# EAGLE design Tacho_StdTeile_panel (EAGLE 6.5.0)

## Sheet 1 of 8
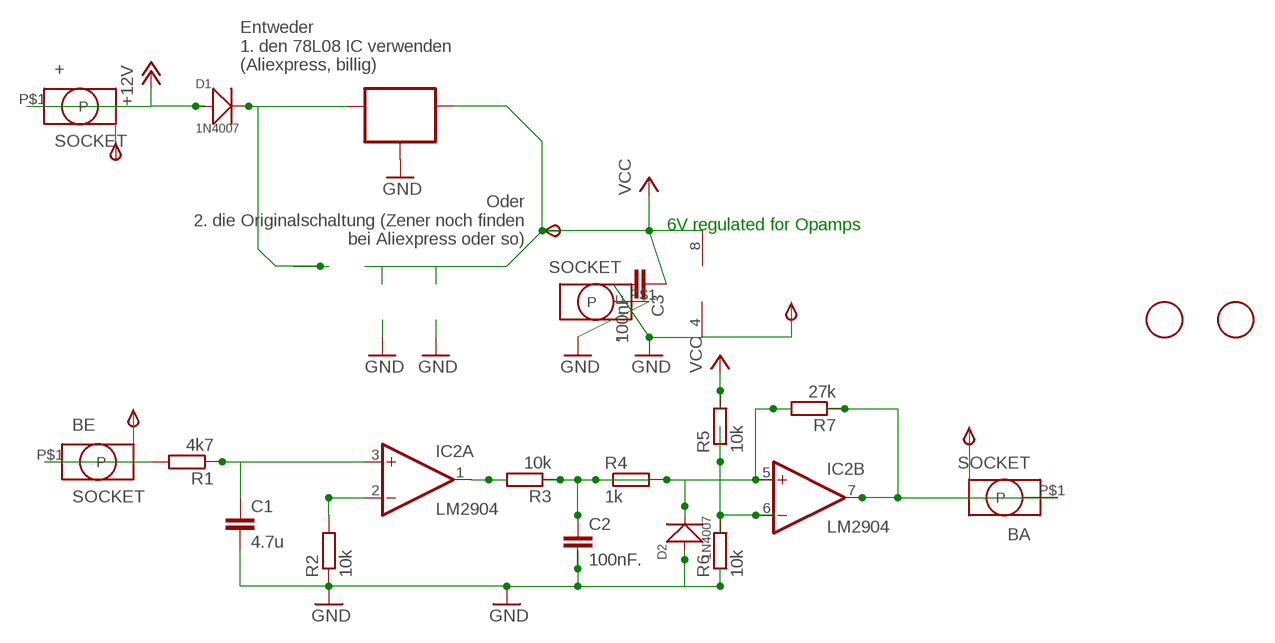
[diagram p0: schematic, sheet 1]

### Parts
6V  TPSB2.0  [B2.0]
+  SOCKET  [ID2.5MM]
+12V  TPSB2.0  [B2.0]
-  SOCKET  [ID2.5MM]
AUS  TPSB2.0  [B2.0]
BA  SOCKET  [ID2.5MM]
BE  SOCKET  [ID2.5MM]
C1  4.7u  C-EUC0805K  [C0805K]
C2  100nF.  C-EUC0805K  [C0805K]
C3  100nF  C-EUC0805K  [C0805K]
D1  1N4007  DIODE-GEN-PURPOSE-1KV-1A(DO-214AC)  [DO-214AC]
D2  1N4007  DIODE-GEN-PURPOSE-1KV-1A(DO-214AC)  [DO-214AC]
EIN  TPSB2.0  [B2.0]
FID2  FIDUCIAL  [FIDUCIAL_1MM]
FID20  FIDUCIAL  [FIDUCIAL_1MM]
GND  TPSB2.0  [B2.0]
IC1  78L06  78LXXSOT89_ROUND  [SOT89_ROUND]
IC2  LM2904  LM358D  [SO08]
R1  4k7  R-EU_R0805  [R0805]
R2  10k  R-EU_R0805  [R0805]
R3  10k  R-EU_R0805  [R0805]
R4  1k  R-EU_R0805  [R0805]
R5  10k  R-EU_R0805  [R0805]
R6  10k  R-EU_R0805  [R0805]
R7  27k  R-EU_R0805  [R0805]

### Nets
+12V: +12V.TP(PP) +.P$1(P) D1.1(+) ; also sheet 2,3,4,5,6,7,8
+12V1: AUS.TP(PP) BA.P$1(P) IC2.7(B:OUT) R7.1
GND: -.P$1(P) C1.2 C2.2 C3.2 D2.1(+) GND.TP(PP) IC1.2(GND) IC1.2@1(GND) IC2.4(P:V-) R2.1 R6.1 ; also sheet 2,3,4,5,6,7,8
N$5: D1.2(-) IC1.3(IN)
N$7: IC2.2(A:-IN) R2.2
N$23: BE.P$1(P) EIN.TP(PP) R1.2
N$24: C1.1 IC2.3(A:+IN) R1.1
N$92: IC2.1(A:OUT) R3.2
N$96: C2.1 R3.1 R4.1
N$97: D2.2(-) IC2.5(B:+IN) R4.2 R7.2
N$101: IC2.6(B:-IN) R5.1 R6.2
VCC: 6V.TP(PP) C3.1 IC1.1(OUT) IC2.8(P:V+) R5.2 ; also sheet 2,3,4,5,6,7,8

### Notes on the sheet
- Entweder
  1. den 78L08 IC verwenden 
  (Aliexpress, billig)
- Oder
  2. die Originalschaltung (Zener noch finden
  bei Aliexpress oder so)
- 6V regulated for Opamps

## Sheet 2 of 8
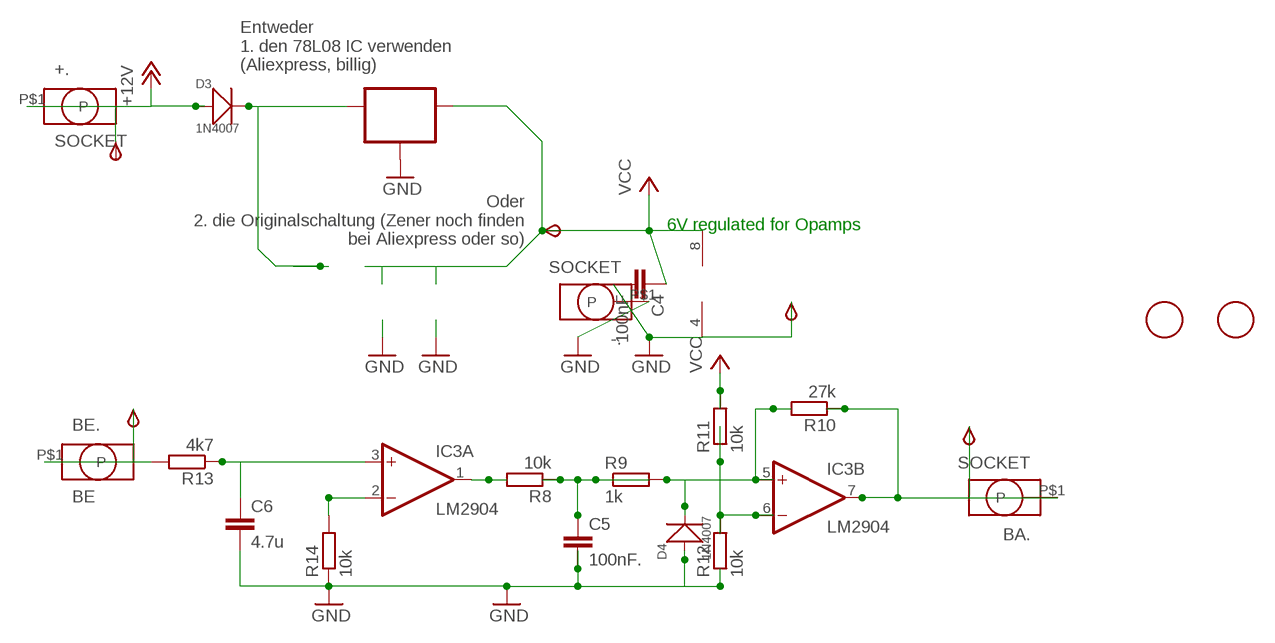
[diagram p1: schematic, sheet 2]

### Parts
6V1  TPSB2.0  [B2.0]
+12V1  TPSB2.0  [B2.0]
+.  SOCKET  [ID2.5MM]
-.  SOCKET  [ID2.5MM]
AUS1  TPSB2.0  [B2.0]
BA.  SOCKET  [ID2.5MM]
BE.  BE  SOCKET  [ID2.5MM]
C4  100nF  C-EUC0805K  [C0805K]
C5  100nF.  C-EUC0805K  [C0805K]
C6  4.7u  C-EUC0805K  [C0805K]
D3  1N4007  DIODE-GEN-PURPOSE-1KV-1A(DO-214AC)  [DO-214AC]
D4  1N4007  DIODE-GEN-PURPOSE-1KV-1A(DO-214AC)  [DO-214AC]
EIN1  TPSB2.0  [B2.0]
FID3  FIDUCIAL  [FIDUCIAL_1MM]
FID4  FIDUCIAL  [FIDUCIAL_1MM]
GND12  TPSB2.0  [B2.0]
IC3  LM2904  LM358D  [SO08]
IC4  78L06  78LXXSOT89_ROUND  [SOT89_ROUND]
R8  10k  R-EU_R0805  [R0805]
R9  1k  R-EU_R0805  [R0805]
R10  27k  R-EU_R0805  [R0805]
R11  10k  R-EU_R0805  [R0805]
R12  10k  R-EU_R0805  [R0805]
R13  4k7  R-EU_R0805  [R0805]
R14  10k  R-EU_R0805  [R0805]

### Nets
+12V: +12V1.TP(PP) +..P$1(P) D3.1(+) ; also sheet 1,3,4,5,6,7,8
+12V2: AUS1.TP(PP) BA..P$1(P) IC3.7(B:OUT) R10.1
GND: -..P$1(P) C4.2 C5.2 C6.2 D4.1(+) GND12.TP(PP) IC3.4(P:V-) IC4.2(GND) IC4.2@1(GND) R12.1 R14.1 ; also sheet 1,3,4,5,6,7,8
N$1: IC3.2(A:-IN) R14.2
N$2: IC3.1(A:OUT) R8.2
N$4: C5.1 R8.1 R9.1
N$6: D4.2(-) IC3.5(B:+IN) R9.2 R10.2
N$8: IC3.6(B:-IN) R11.1 R12.2
N$9: BE..P$1(P) EIN1.TP(PP) R13.2
N$10: C6.1 IC3.3(A:+IN) R13.1
N$11: D3.2(-) IC4.3(IN)
VCC: 6V1.TP(PP) C4.1 IC3.8(P:V+) IC4.1(OUT) R11.2 ; also sheet 1,3,4,5,6,7,8

### Notes on the sheet
- Entweder
  1. den 78L08 IC verwenden 
  (Aliexpress, billig)
- Oder
  2. die Originalschaltung (Zener noch finden
  bei Aliexpress oder so)
- 6V regulated for Opamps

## Sheet 3 of 8
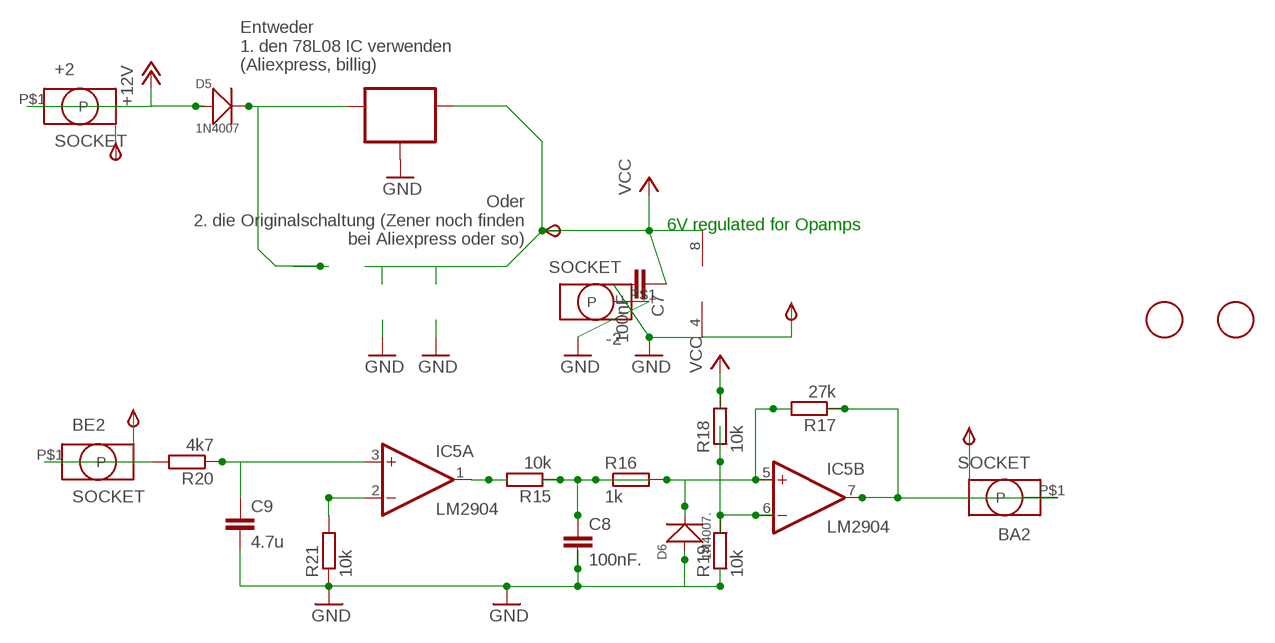
[diagram p2: schematic, sheet 3]

### Parts
6V2  TPSB2.0  [B2.0]
+2  SOCKET  [ID2.5MM]
+12V2  TPSB2.0  [B2.0]
-2  SOCKET  [ID2.5MM]
AUS2  TPSB2.0  [B2.0]
BA2  SOCKET  [ID2.5MM]
BE2  SOCKET  [ID2.5MM]
C7  100nF  C-EUC0805K  [C0805K]
C8  100nF.  C-EUC0805K  [C0805K]
C9  4.7u  C-EUC0805K  [C0805K]
D5  1N4007  DIODE-GEN-PURPOSE-1KV-1A(DO-214AC)  [DO-214AC]
D6  1N4007.  DIODE-GEN-PURPOSE-1KV-1A(DO-214AC)  [DO-214AC]
EIN2  TPSB2.0  [B2.0]
FID5  FIDUCIAL  [FIDUCIAL_1MM]
FID6  FIDUCIAL  [FIDUCIAL_1MM]
GND20  TPSB2.0  [B2.0]
IC5  LM2904  LM358D  [SO08]
IC6  78L06  78LXXSOT89_ROUND  [SOT89_ROUND]
R15  10k  R-EU_R0805  [R0805]
R16  1k  R-EU_R0805  [R0805]
R17  27k  R-EU_R0805  [R0805]
R18  10k  R-EU_R0805  [R0805]
R19  10k  R-EU_R0805  [R0805]
R20  4k7  R-EU_R0805  [R0805]
R21  10k  R-EU_R0805  [R0805]

### Nets
+12V: +2.P$1(P) +12V2.TP(PP) D5.1(+) ; also sheet 1,2,4,5,6,7,8
+12V3: AUS2.TP(PP) BA2.P$1(P) IC5.7(B:OUT) R17.1
GND: -2.P$1(P) C7.2 C8.2 C9.2 D6.1(+) GND20.TP(PP) IC5.4(P:V-) IC6.2(GND) IC6.2@1(GND) R19.1 R21.1 ; also sheet 1,2,4,5,6,7,8
N$17: IC5.2(A:-IN) R21.2
N$18: IC5.1(A:OUT) R15.2
N$19: C8.1 R15.1 R16.1
N$20: D6.2(-) IC5.5(B:+IN) R16.2 R17.2
N$21: IC5.6(B:-IN) R18.1 R19.2
N$22: BE2.P$1(P) EIN2.TP(PP) R20.2
N$25: C9.1 IC5.3(A:+IN) R20.1
N$26: D5.2(-) IC6.3(IN)
VCC: 6V2.TP(PP) C7.1 IC5.8(P:V+) IC6.1(OUT) R18.2 ; also sheet 1,2,4,5,6,7,8

### Notes on the sheet
- Entweder
  1. den 78L08 IC verwenden 
  (Aliexpress, billig)
- Oder
  2. die Originalschaltung (Zener noch finden
  bei Aliexpress oder so)
- 6V regulated for Opamps

## Sheet 4 of 8
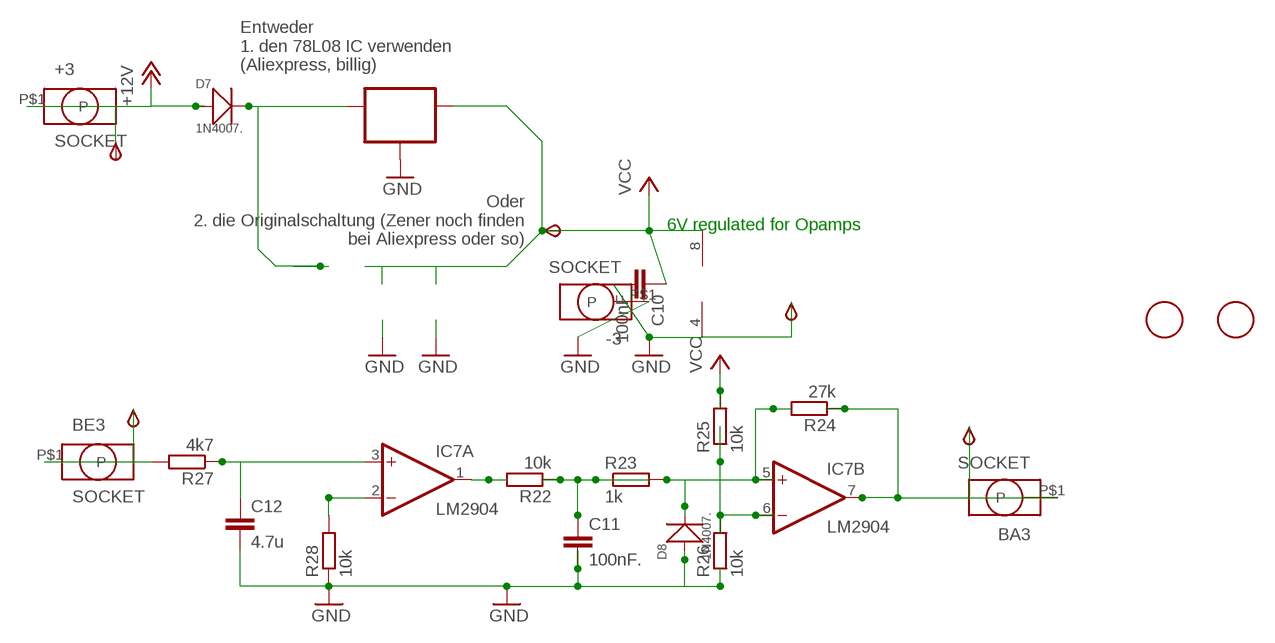
[diagram p3: schematic, sheet 4]

### Parts
6V3  TPSB2.0  [B2.0]
+3  SOCKET  [ID2.5MM]
+12V3  TPSB2.0  [B2.0]
-3  SOCKET  [ID2.5MM]
AUS3  TPSB2.0  [B2.0]
BA3  SOCKET  [ID2.5MM]
BE3  SOCKET  [ID2.5MM]
C10  100nF  C-EUC0805K  [C0805K]
C11  100nF.  C-EUC0805K  [C0805K]
C12  4.7u  C-EUC0805K  [C0805K]
D7  1N4007.  DIODE-GEN-PURPOSE-1KV-1A(DO-214AC)  [DO-214AC]
D8  1N4007.  DIODE-GEN-PURPOSE-1KV-1A(DO-214AC)  [DO-214AC]
EIN3  TPSB2.0  [B2.0]
FID7  FIDUCIAL  [FIDUCIAL_1MM]
FID8  FIDUCIAL  [FIDUCIAL_1MM]
GND29  TPSB2.0  [B2.0]
IC7  LM2904  LM358D  [SO08]
IC8  78L06  78LXXSOT89_ROUND  [SOT89_ROUND]
R22  10k  R-EU_R0805  [R0805]
R23  1k  R-EU_R0805  [R0805]
R24  27k  R-EU_R0805  [R0805]
R25  10k  R-EU_R0805  [R0805]
R26  10k  R-EU_R0805  [R0805]
R27  4k7  R-EU_R0805  [R0805]
R28  10k  R-EU_R0805  [R0805]

### Nets
+12V: +3.P$1(P) +12V3.TP(PP) D7.1(+) ; also sheet 1,2,3,5,6,7,8
+12V4: AUS3.TP(PP) BA3.P$1(P) IC7.7(B:OUT) R24.1
GND: -3.P$1(P) C10.2 C11.2 C12.2 D8.1(+) GND29.TP(PP) IC7.4(P:V-) IC8.2(GND) IC8.2@1(GND) R26.1 R28.1 ; also sheet 1,2,3,5,6,7,8
N$27: IC7.2(A:-IN) R28.2
N$28: IC7.1(A:OUT) R22.2
N$29: C11.1 R22.1 R23.1
N$30: D8.2(-) IC7.5(B:+IN) R23.2 R24.2
N$31: IC7.6(B:-IN) R25.1 R26.2
N$32: BE3.P$1(P) EIN3.TP(PP) R27.2
N$33: C12.1 IC7.3(A:+IN) R27.1
N$34: D7.2(-) IC8.3(IN)
VCC: 6V3.TP(PP) C10.1 IC7.8(P:V+) IC8.1(OUT) R25.2 ; also sheet 1,2,3,5,6,7,8

### Notes on the sheet
- Entweder
  1. den 78L08 IC verwenden 
  (Aliexpress, billig)
- Oder
  2. die Originalschaltung (Zener noch finden
  bei Aliexpress oder so)
- 6V regulated for Opamps

## Sheet 5 of 8
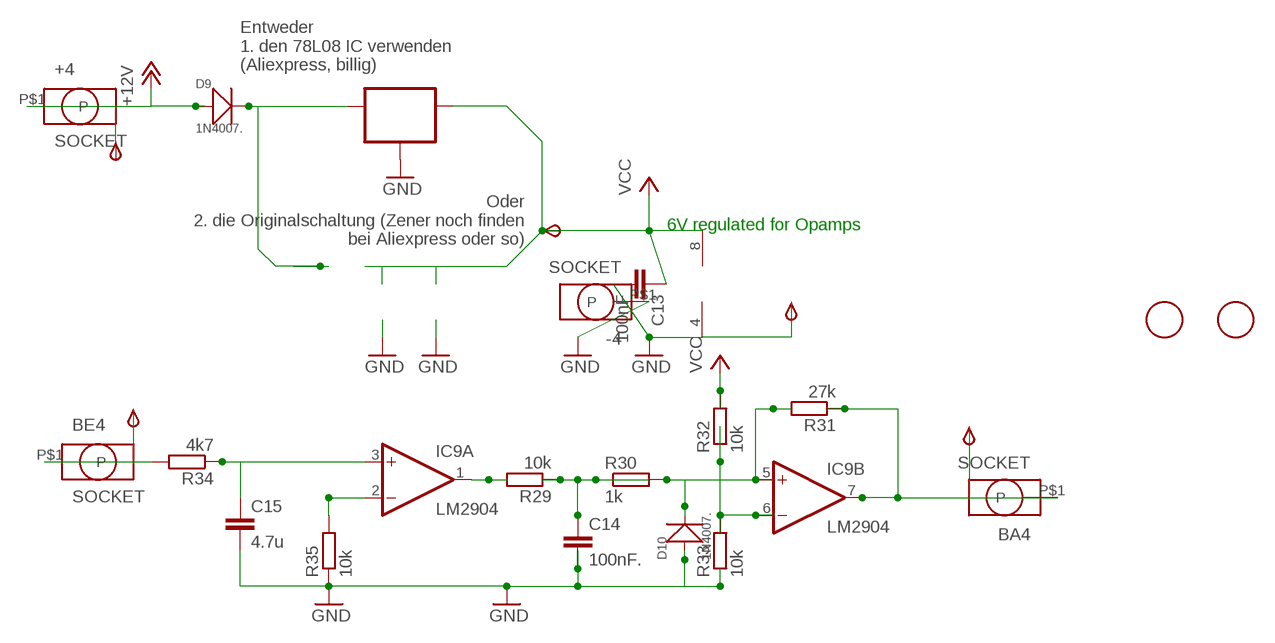
[diagram p4: schematic, sheet 5]

### Parts
6V4  TPSB2.0  [B2.0]
+4  SOCKET  [ID2.5MM]
+12V4  TPSB2.0  [B2.0]
-4  SOCKET  [ID2.5MM]
AUS4  TPSB2.0  [B2.0]
BA4  SOCKET  [ID2.5MM]
BE4  SOCKET  [ID2.5MM]
C13  100nF  C-EUC0805K  [C0805K]
C14  100nF.  C-EUC0805K  [C0805K]
C15  4.7u  C-EUC0805K  [C0805K]
D9  1N4007.  DIODE-GEN-PURPOSE-1KV-1A(DO-214AC)  [DO-214AC]
D10  1N4007.  DIODE-GEN-PURPOSE-1KV-1A(DO-214AC)  [DO-214AC]
EIN4  TPSB2.0  [B2.0]
FID9  FIDUCIAL  [FIDUCIAL_1MM]
FID10  FIDUCIAL  [FIDUCIAL_1MM]
GND39  TPSB2.0  [B2.0]
IC9  LM2904  LM358D  [SO08]
IC10  78L06  78LXXSOT89_ROUND  [SOT89_ROUND]
R29  10k  R-EU_R0805  [R0805]
R30  1k  R-EU_R0805  [R0805]
R31  27k  R-EU_R0805  [R0805]
R32  10k  R-EU_R0805  [R0805]
R33  10k  R-EU_R0805  [R0805]
R34  4k7  R-EU_R0805  [R0805]
R35  10k  R-EU_R0805  [R0805]

### Nets
+12V: +4.P$1(P) +12V4.TP(PP) D9.1(+) ; also sheet 1,2,3,4,6,7,8
+12V5: AUS4.TP(PP) BA4.P$1(P) IC9.7(B:OUT) R31.1
GND: -4.P$1(P) C13.2 C14.2 C15.2 D10.1(+) GND39.TP(PP) IC9.4(P:V-) IC10.2(GND) IC10.2@1(GND) R33.1 R35.1 ; also sheet 1,2,3,4,6,7,8
N$46: IC9.2(A:-IN) R35.2
N$47: IC9.1(A:OUT) R29.2
N$48: C14.1 R29.1 R30.1
N$49: D10.2(-) IC9.5(B:+IN) R30.2 R31.2
N$50: IC9.6(B:-IN) R32.1 R33.2
N$51: BE4.P$1(P) EIN4.TP(PP) R34.2
N$52: C15.1 IC9.3(A:+IN) R34.1
N$53: D9.2(-) IC10.3(IN)
VCC: 6V4.TP(PP) C13.1 IC9.8(P:V+) IC10.1(OUT) R32.2 ; also sheet 1,2,3,4,6,7,8

### Notes on the sheet
- Entweder
  1. den 78L08 IC verwenden 
  (Aliexpress, billig)
- Oder
  2. die Originalschaltung (Zener noch finden
  bei Aliexpress oder so)
- 6V regulated for Opamps

## Sheet 6 of 8
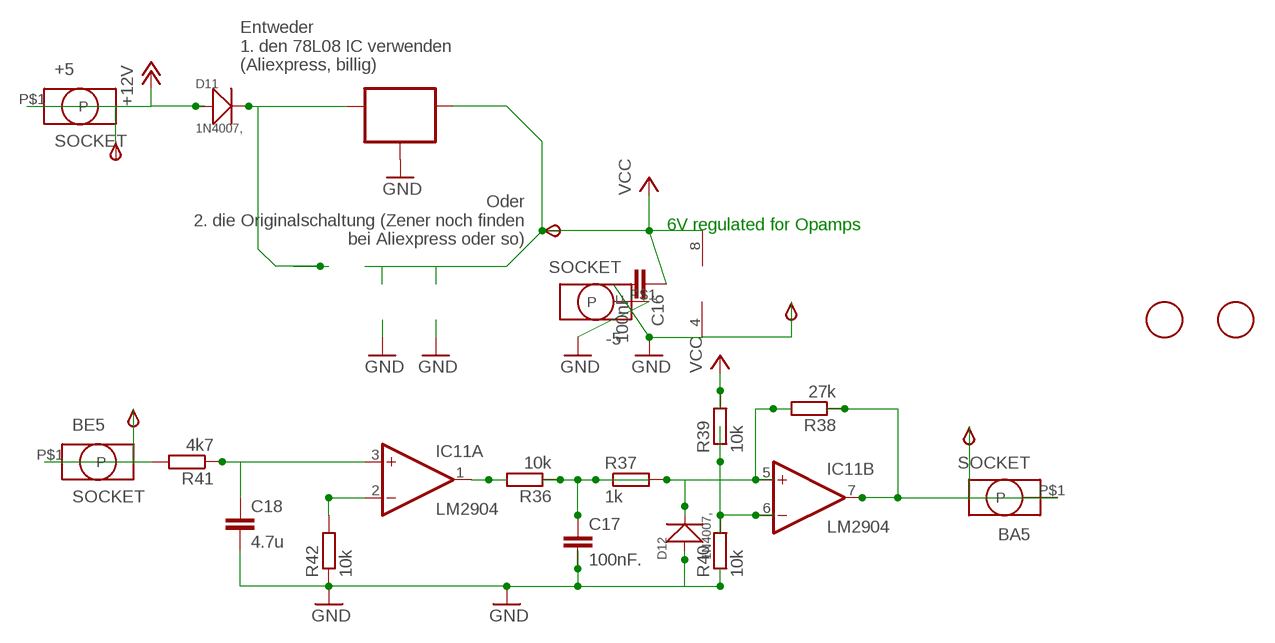
[diagram p5: schematic, sheet 6]

### Parts
6V5  TPSB2.0  [B2.0]
+5  SOCKET  [ID2.5MM]
+12V5  TPSB2.0  [B2.0]
-5  SOCKET  [ID2.5MM]
AUS5  TPSB2.0  [B2.0]
BA5  SOCKET  [ID2.5MM]
BE5  SOCKET  [ID2.5MM]
C16  100nF  C-EUC0805K  [C0805K]
C17  100nF.  C-EUC0805K  [C0805K]
C18  4.7u  C-EUC0805K  [C0805K]
D11  1N4007,  DIODE-GEN-PURPOSE-1KV-1A(DO-214AC)  [DO-214AC]
D12  1N4007,  DIODE-GEN-PURPOSE-1KV-1A(DO-214AC)  [DO-214AC]
EIN5  TPSB2.0  [B2.0]
FID11  FIDUCIAL  [FIDUCIAL_1MM]
FID12  FIDUCIAL  [FIDUCIAL_1MM]
GND47  TPSB2.0  [B2.0]
IC11  LM2904  LM358D  [SO08]
IC12  78L06  78LXXSOT89_ROUND  [SOT89_ROUND]
R36  10k  R-EU_R0805  [R0805]
R37  1k  R-EU_R0805  [R0805]
R38  27k  R-EU_R0805  [R0805]
R39  10k  R-EU_R0805  [R0805]
R40  10k  R-EU_R0805  [R0805]
R41  4k7  R-EU_R0805  [R0805]
R42  10k  R-EU_R0805  [R0805]

### Nets
+12V: +5.P$1(P) +12V5.TP(PP) D11.1(+) ; also sheet 1,2,3,4,5,7,8
+12V6: AUS5.TP(PP) BA5.P$1(P) IC11.7(B:OUT) R38.1
GND: -5.P$1(P) C16.2 C17.2 C18.2 D12.1(+) GND47.TP(PP) IC11.4(P:V-) IC12.2(GND) IC12.2@1(GND) R40.1 R42.1 ; also sheet 1,2,3,4,5,7,8
N$54: IC11.2(A:-IN) R42.2
N$55: IC11.1(A:OUT) R36.2
N$56: C17.1 R36.1 R37.1
N$57: D12.2(-) IC11.5(B:+IN) R37.2 R38.2
N$58: IC11.6(B:-IN) R39.1 R40.2
N$59: BE5.P$1(P) EIN5.TP(PP) R41.2
N$60: C18.1 IC11.3(A:+IN) R41.1
N$61: D11.2(-) IC12.3(IN)
VCC: 6V5.TP(PP) C16.1 IC11.8(P:V+) IC12.1(OUT) R39.2 ; also sheet 1,2,3,4,5,7,8

### Notes on the sheet
- Entweder
  1. den 78L08 IC verwenden 
  (Aliexpress, billig)
- Oder
  2. die Originalschaltung (Zener noch finden
  bei Aliexpress oder so)
- 6V regulated for Opamps

## Sheet 7 of 8
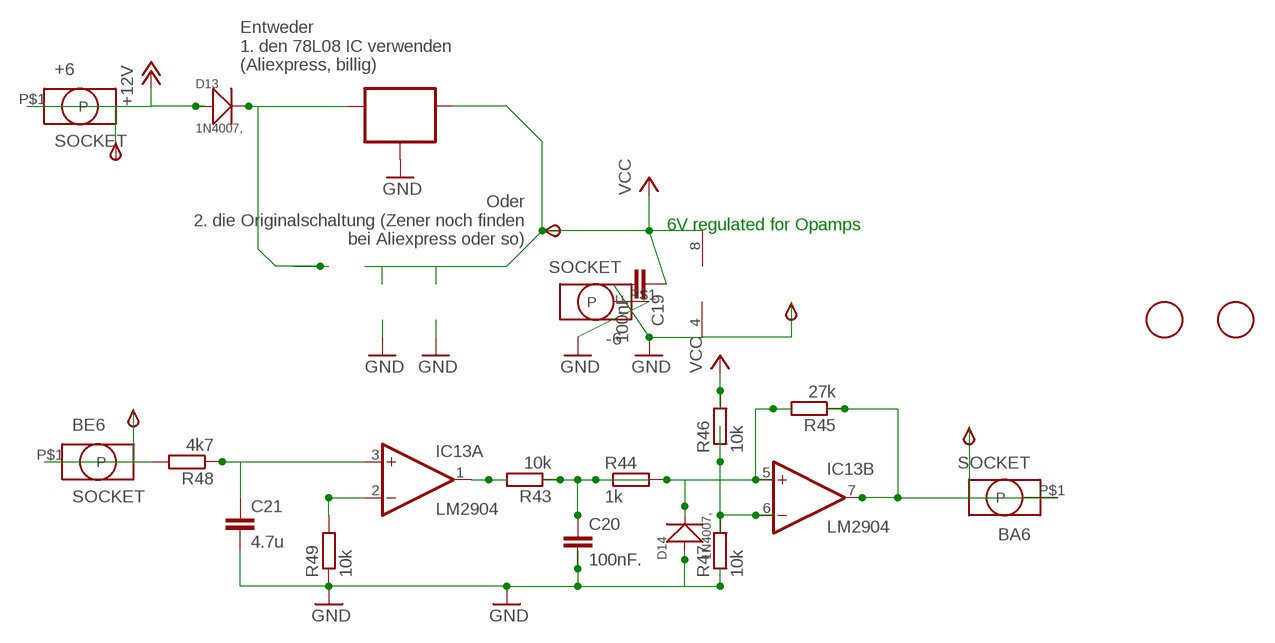
[diagram p6: schematic, sheet 7]

### Parts
6V6  TPSB2.0  [B2.0]
+6  SOCKET  [ID2.5MM]
+12V6  TPSB2.0  [B2.0]
-6  SOCKET  [ID2.5MM]
AUS6  TPSB2.0  [B2.0]
BA6  SOCKET  [ID2.5MM]
BE6  SOCKET  [ID2.5MM]
C19  100nF  C-EUC0805K  [C0805K]
C20  100nF.  C-EUC0805K  [C0805K]
C21  4.7u  C-EUC0805K  [C0805K]
D13  1N4007,  DIODE-GEN-PURPOSE-1KV-1A(DO-214AC)  [DO-214AC]
D14  1N4007,  DIODE-GEN-PURPOSE-1KV-1A(DO-214AC)  [DO-214AC]
EIN6  TPSB2.0  [B2.0]
FID13  FIDUCIAL  [FIDUCIAL_1MM]
FID14  FIDUCIAL  [FIDUCIAL_1MM]
GND55  TPSB2.0  [B2.0]
IC13  LM2904  LM358D  [SO08]
IC14  78L06  78LXXSOT89_ROUND  [SOT89_ROUND]
R43  10k  R-EU_R0805  [R0805]
R44  1k  R-EU_R0805  [R0805]
R45  27k  R-EU_R0805  [R0805]
R46  10k  R-EU_R0805  [R0805]
R47  10k  R-EU_R0805  [R0805]
R48  4k7  R-EU_R0805  [R0805]
R49  10k  R-EU_R0805  [R0805]

### Nets
+12V: +6.P$1(P) +12V6.TP(PP) D13.1(+) ; also sheet 1,2,3,4,5,6,8
+12V7: AUS6.TP(PP) BA6.P$1(P) IC13.7(B:OUT) R45.1
GND: -6.P$1(P) C19.2 C20.2 C21.2 D14.1(+) GND55.TP(PP) IC13.4(P:V-) IC14.2(GND) IC14.2@1(GND) R47.1 R49.1 ; also sheet 1,2,3,4,5,6,8
N$63: IC13.2(A:-IN) R49.2
N$64: IC13.1(A:OUT) R43.2
N$65: C20.1 R43.1 R44.1
N$67: D14.2(-) IC13.5(B:+IN) R44.2 R45.2
N$69: IC13.6(B:-IN) R46.1 R47.2
N$70: BE6.P$1(P) EIN6.TP(PP) R48.2
N$71: C21.1 IC13.3(A:+IN) R48.1
N$72: D13.2(-) IC14.3(IN)
VCC: 6V6.TP(PP) C19.1 IC13.8(P:V+) IC14.1(OUT) R46.2 ; also sheet 1,2,3,4,5,6,8

### Notes on the sheet
- Entweder
  1. den 78L08 IC verwenden 
  (Aliexpress, billig)
- Oder
  2. die Originalschaltung (Zener noch finden
  bei Aliexpress oder so)
- 6V regulated for Opamps

## Sheet 8 of 8
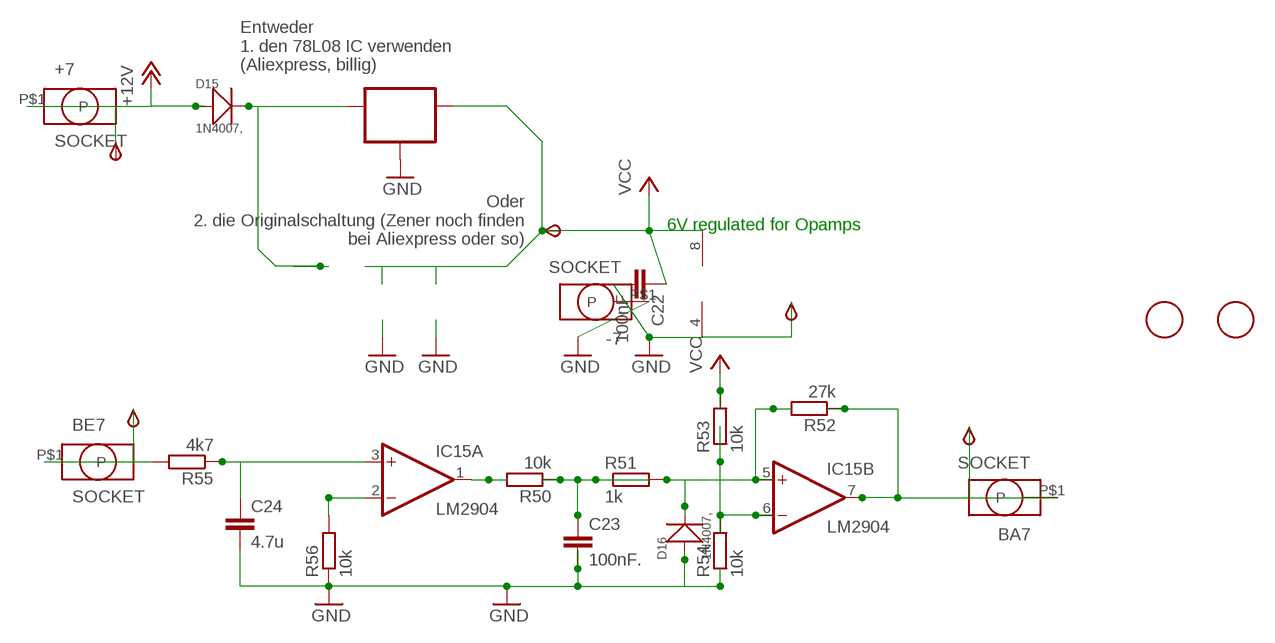
[diagram p7: schematic, sheet 8]

### Parts
6V7  TPSB2.0  [B2.0]
+7  SOCKET  [ID2.5MM]
+12V7  TPSB2.0  [B2.0]
-7  SOCKET  [ID2.5MM]
AUS7  TPSB2.0  [B2.0]
BA7  SOCKET  [ID2.5MM]
BE7  SOCKET  [ID2.5MM]
C22  100nF  C-EUC0805K  [C0805K]
C23  100nF.  C-EUC0805K  [C0805K]
C24  4.7u  C-EUC0805K  [C0805K]
D15  1N4007,  DIODE-GEN-PURPOSE-1KV-1A(DO-214AC)  [DO-214AC]
D16  1N4007,  DIODE-GEN-PURPOSE-1KV-1A(DO-214AC)  [DO-214AC]
EIN7  TPSB2.0  [B2.0]
FID1  FIDUCIAL  [FIDUCIAL_1MM]
FID19  FIDUCIAL  [FIDUCIAL_1MM]
GND63  TPSB2.0  [B2.0]
IC15  LM2904  LM358D  [SO08]
IC16  78L06  78LXXSOT89_ROUND  [SOT89_ROUND]
R50  10k  R-EU_R0805  [R0805]
R51  1k  R-EU_R0805  [R0805]
R52  27k  R-EU_R0805  [R0805]
R53  10k  R-EU_R0805  [R0805]
R54  10k  R-EU_R0805  [R0805]
R55  4k7  R-EU_R0805  [R0805]
R56  10k  R-EU_R0805  [R0805]

### Nets
+12V: +7.P$1(P) +12V7.TP(PP) D15.1(+) ; also sheet 1,2,3,4,5,6,7
+12V8: AUS7.TP(PP) BA7.P$1(P) IC15.7(B:OUT) R52.1
GND: -7.P$1(P) C22.2 C23.2 C24.2 D16.1(+) GND63.TP(PP) IC15.4(P:V-) IC16.2(GND) IC16.2@1(GND) R54.1 R56.1 ; also sheet 1,2,3,4,5,6,7
N$73: IC15.2(A:-IN) R56.2
N$74: IC15.1(A:OUT) R50.2
N$76: C23.1 R50.1 R51.1
N$77: D16.2(-) IC15.5(B:+IN) R51.2 R52.2
N$78: IC15.6(B:-IN) R53.1 R54.2
N$79: BE7.P$1(P) EIN7.TP(PP) R55.2
N$80: C24.1 IC15.3(A:+IN) R55.1
N$81: D15.2(-) IC16.3(IN)
VCC: 6V7.TP(PP) C22.1 IC15.8(P:V+) IC16.1(OUT) R53.2 ; also sheet 1,2,3,4,5,6,7

### Notes on the sheet
- Entweder
  1. den 78L08 IC verwenden 
  (Aliexpress, billig)
- Oder
  2. die Originalschaltung (Zener noch finden
  bei Aliexpress oder so)
- 6V regulated for Opamps

## Library data of the parts
6V 6V1-6V7 +12V +12V1-+12V7 AUS AUS1-AUS7 EIN EIN1-EIN7 GND GND12 GND20 GND29 GND39 GND47 GND55 GND63 = testpin_BMW:TPS: TEST PIN
+ +2-+7 +. - -2--7 -. BA BA2-BA7 BA. BE BE2-BE7 BE. = Brotbox_Socket_Header:SOCKET
C1-C24 = rcl:C-EU: CAPACITOR, European symbol
D1-D5 = Diode-do214ac:DIODE-GEN-PURPOSE-1KV-1A(DO-214AC): 304010013; MPN: 1N4007
D6-D16 = Diode-do214ac:DIODE-GEN-PURPOSE-1KV-1A(DO-214AC): 304010013; MPN: 1N4007; VALUE: 1N4007
FID1-FID14 FID19 FID20 = Fiducial:FIDUCIAL: For use by pick and place machines to calibrate the vision/machine, 1mm By microbuilder.eu
IC1 IC4 IC6 IC8 IC10 IC12 IC14 IC16 = 78LXX:78LXX
IC2 IC3 IC5 IC7 IC9 IC11 IC13 IC15 = linear_BMW:LM358: OP AMP also LM158; LM258; LM2904 Source: http://cache.national.com/ds/LM/LM158.pdf
R1-R56 = rcl:R-EU_: RESISTOR, European symbol

## Board
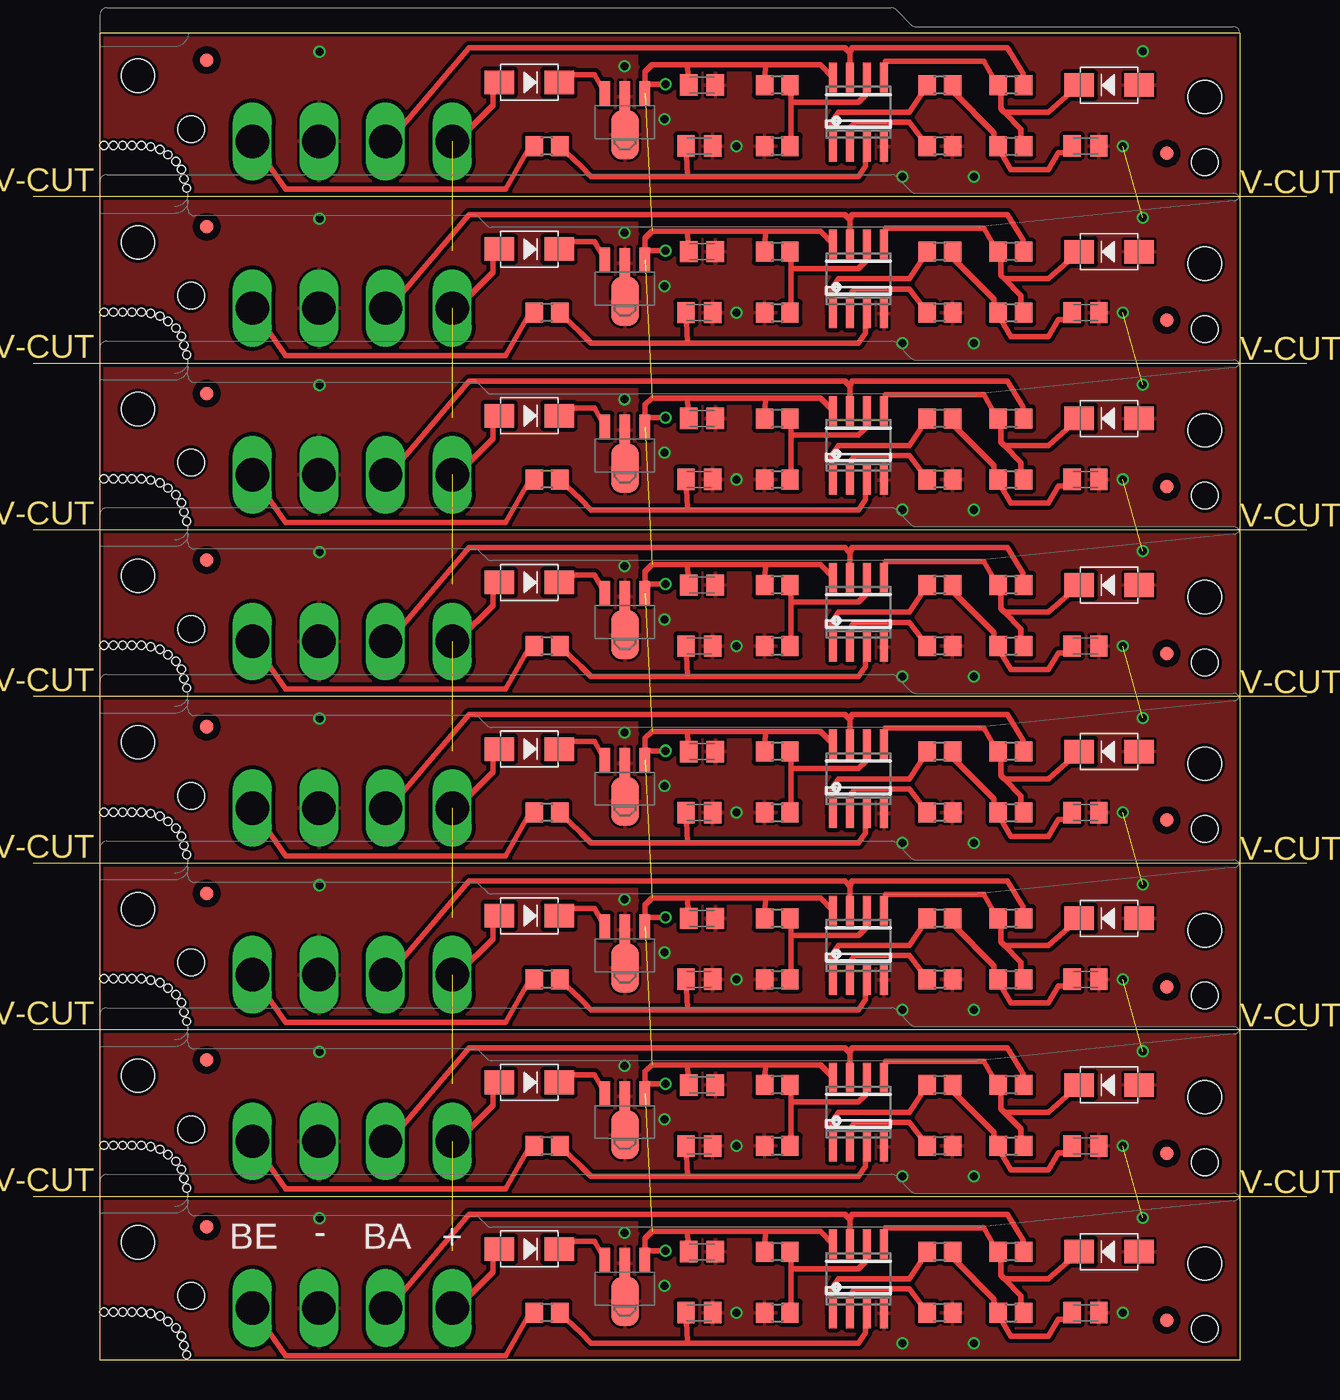
[diagram p8: board, top side]
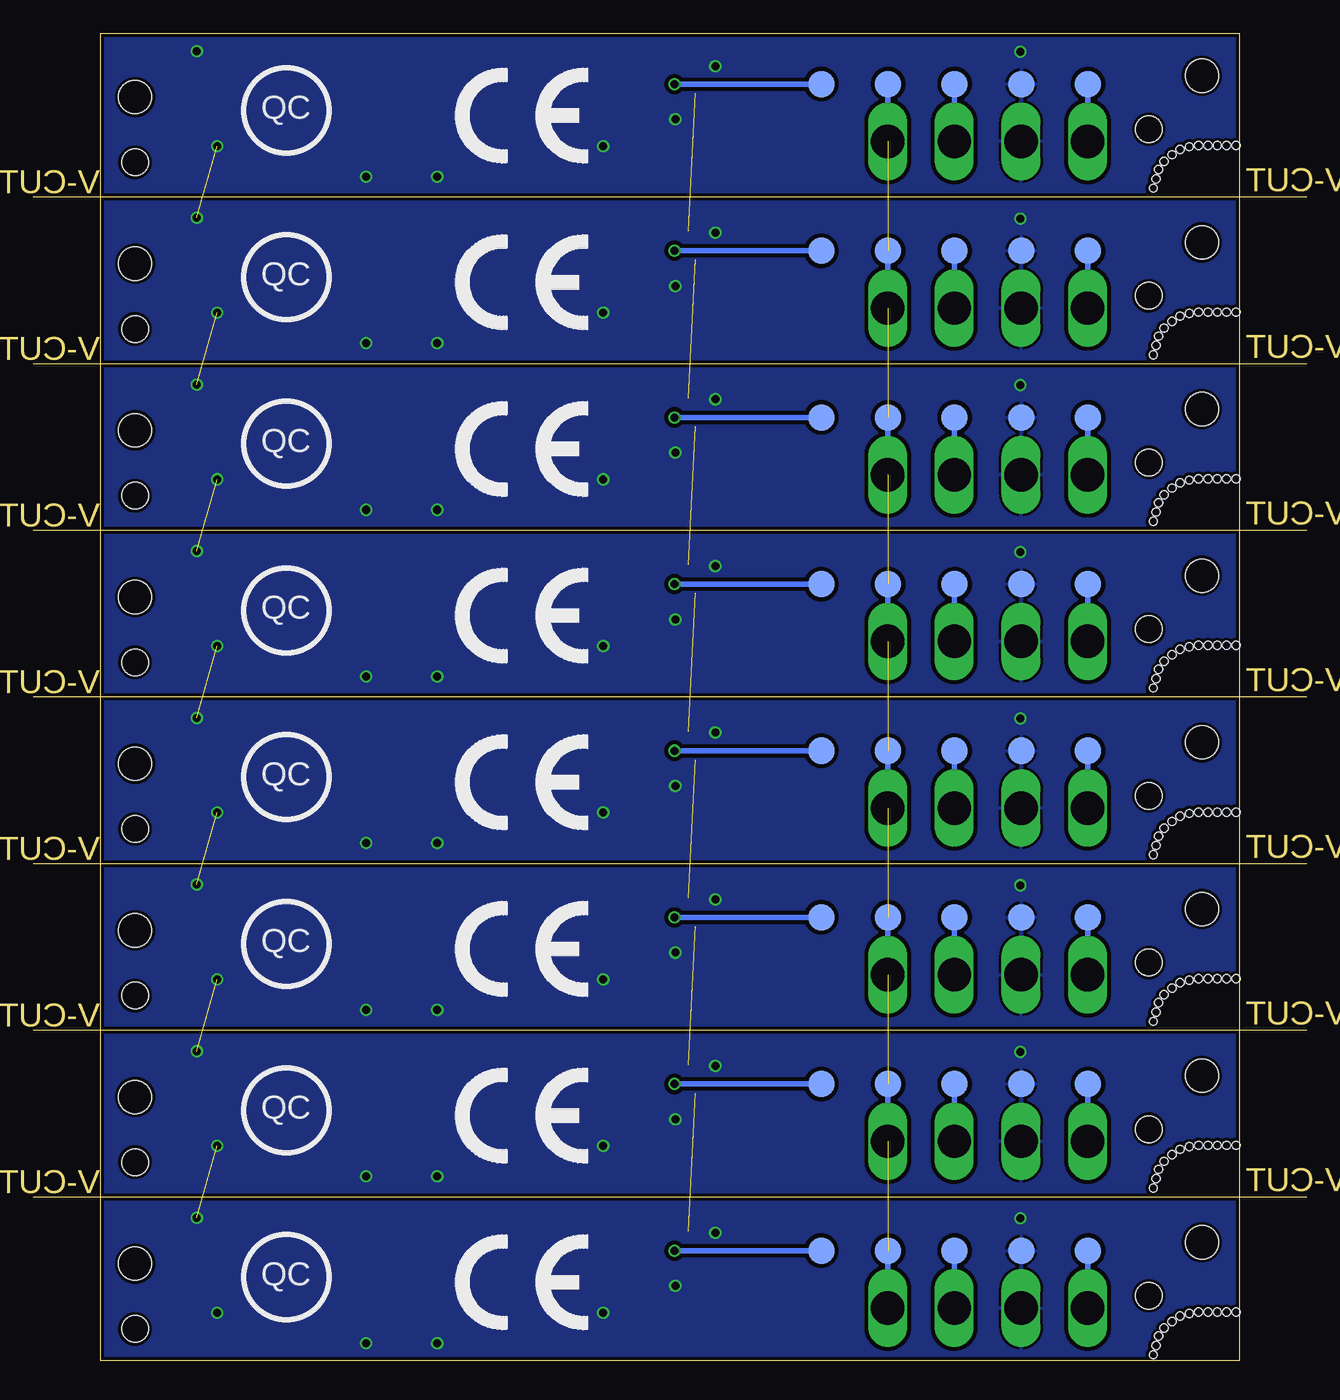
[diagram p9: board, bottom side, seen from below]

Size 95.5 x 99.51 mm. Coordinates in mm from the lower left corner, seen from the top.
Outline: 90.5,12.01 90.5,12
Outline: 95.5,12.25 0,12.25
Outline: 90.5,24.51 90.5,24.5
Outline: 90.5,12.25 5,12.25
Outline: 95.5,24.75 0,24.75
Outline: 90.5,37.01 90.5,37
Outline: 90.5,24.75 5,24.75
Outline: 95.5,37.25 0,37.25
Outline: 90.5,49.51 90.5,49.5
Outline: 5,37.5 5,49.5
Outline: 90.5,37.25 5,37.25
Outline: 95.5,49.75 0,49.75
Outline: 90.5,62.01 90.5,62
Outline: 5,50 5,62
Outline: 90.5,49.75 5,49.75
Outline: 95.5,62.25 0,62.25
Outline: 90.5,74.51 90.5,74.5
Outline: 5,62.5 5,74.5
Outline: 90.5,62.25 5,62.25
Outline: 95.5,74.75 0,74.75
Outline: 90.5,87.01 90.5,87
Outline: 5,75 5,87
Outline: 90.5,74.75 5,74.75
Outline: 95.5,87.25 0,87.25
Outline: 90.5,99.51 90.5,99.5
Outline: 90.5,99.5 90.5,0 5,0 5,99.5 90.5,99.5
Outline: 90.5,87.25 5,87.25
Copper layers (1*16): Top 0.035mm / dielectric 1.5mm / Bottom 0.035mm
Design rules "multi-cb_035um-cu *": minimum track width 12mil, minimum drill 12mil, track to track 12mil, track to pad 12mil, pad to pad 6mil, via to via 6mil, smd to smd 6mil, copper to edge 10mil, drill to drill 8mil, minimum pad ring 8mil, minimum via ring 6mil, stop-mask expansion 3mil, vias tented up to drill 0mil, thermal gap 8mil
Holes 2.5 mm at 7.85,8.83 87.87,7.23 7.85,21.33 87.87,19.73 7.85,33.83 87.87,32.23 7.85,46.33 87.87,44.73 7.85,58.83 87.87,57.23 7.85,71.33 87.87,69.73 7.85,83.83 87.87,82.23 7.85,96.33 87.87,94.73
Holes 2 mm at 11.83,4.82 87.87,2.33 11.83,17.32 87.87,14.83 11.83,29.82 87.87,27.33 11.83,42.32 87.87,39.83 11.83,54.82 87.87,52.33 11.83,67.32 87.87,64.83 11.83,79.82 87.87,77.33 11.83,92.32 87.87,89.83
Holes 0.6 mm at 11.5,0.4 11.3,1.1 11.1,1.8 10.7,2.4 10.1,2.9 9.5,3.3 8.8,3.5 8.1,3.6 7.4,3.6 6.7,3.6 6,3.6 5.3,3.6 11.5,12.9 11.3,13.6 11.1,14.3 10.7,14.9 10.1,15.4 9.5,15.8 8.8,16 8.1,16.1 7.4,16.1 6.7,16.1 6,16.1 5.3,16.1 11.5,25.4 11.3,26.1 11.1,26.8 10.7,27.4 10.1,27.9 9.5,28.3 8.8,28.5 8.1,28.6 7.4,28.6 6.7,28.6 6,28.6 5.3,28.6 11.5,37.9 11.3,38.6 11.1,39.3 10.7,39.9 10.1,40.4 9.5,40.8 8.8,41 8.1,41.1 7.4,41.1 6.7,41.1 6,41.1 5.3,41.1 11.5,50.4 11.3,51.1 11.1,51.8 10.7,52.4 10.1,52.9 9.5,53.3 8.8,53.5 8.1,53.6 7.4,53.6 6.7,53.6 6,53.6 5.3,53.6 11.5,62.9 11.3,63.6 11.1,64.3 10.7,64.9 10.1,65.4 9.5,65.8 8.8,66 8.1,66.1 7.4,66.1 6.7,66.1 6,66.1 5.3,66.1 11.5,75.4 11.3,76.1 11.1,76.8 10.7,77.4 10.1,77.9 9.5,78.3 8.8,78.5 8.1,78.6 7.4,78.6 6.7,78.6 6,78.6 5.3,78.6 11.5,87.9 11.3,88.6 11.1,89.3 10.7,89.9 10.1,90.4 9.5,90.8 8.8,91 8.1,91.1 7.4,91.1 6.7,91.1 6,91.1 5.3,91.1
tRestrict: area 45.4,9.6 to 60.8,10.4; area 45.4,22.1 to 60.8,22.9; area 45.4,34.6 to 60.8,35.4; area 45.4,47.1 to 60.8,47.9; area 45.4,59.6 to 60.8,60.4; area 45.4,72.1 to 60.8,72.9; area 45.4,84.6 to 60.8,85.4; area 45.4,97.1 to 60.8,97.9

### Footprints (pad centres in the part's own frame; a part is rotated, then mirrored left to right if it is on the bottom)
B2.0 = smd 2 x 2: TP 0,0
ID2.5MM = drill 2.5 long: P$1 0,0
C0805K = smd 1.3 x 1.6: 1 -1,0; 2 1,0
DO-214AC = smd 2.2 x 1.77: 1 -2.242,0; 2 2.242,0
FIDUCIAL_1MM = smd 1 x 1: 1 0,0
SOT89_ROUND = smd 0.8 x 1.8: 1 -1.499,-2.181; 3 1.499,-2.181 | smd 0.8 x 2.3: 2 0,-1.927 | smd 2.032 x 3.65: 2@1 0,0.94
SO08 = smd 0.6 x 2.2: 1 -1.905,-2.6; 2 -0.635,-2.6; 3 0.635,-2.6; 4 1.905,-2.6; 5 1.905,2.6; 6 0.635,2.6; 7 -0.635,2.6; 8 -1.905,2.6
R0805 = smd 1.3 x 1.5: 1 -0.95,0; 2 0.95,0

### Placement (x,y rotation side)
6V  36.4,8.2 0 bottom
6V1  36.4,20.7 0 bottom
6V2  36.4,33.2 0 bottom
6V3  36.4,45.7 0 bottom
6V4  36.4,58.2 0 bottom
6V5  36.4,70.7 0 bottom
6V6  36.4,83.2 0 bottom
6V7  36.4,95.7 0 bottom
+  31.42,3.9 90 top
+2  31.42,28.9 90 top
+3  31.42,41.4 90 top
+4  31.42,53.9 90 top
+5  31.42,66.4 90 top
+6  31.42,78.9 90 top
+7  31.42,91.4 90 top
+12V  31.4,8.2 0 bottom
+12V1  31.4,20.7 0 bottom
+12V2  31.4,33.2 0 bottom
+12V3  31.4,45.7 0 bottom
+12V4  31.4,58.2 0 bottom
+12V5  31.4,70.7 0 bottom
+12V6  31.4,83.2 0 bottom
+12V7  31.4,95.7 0 bottom
+.  31.42,16.4 90 top
-  21.42,3.9 90 top
-2  21.42,28.9 90 top
-3  21.42,41.4 90 top
-4  21.42,53.9 90 top
-5  21.42,66.4 90 top
-6  21.42,78.9 90 top
-7  21.42,91.4 90 top
-.  21.42,16.4 90 top
AUS  26.4,8.2 0 bottom
AUS1  26.4,20.7 0 bottom
AUS2  26.4,33.2 0 bottom
AUS3  26.4,45.7 0 bottom
AUS4  26.4,58.2 0 bottom
AUS5  26.4,70.7 0 bottom
AUS6  26.4,83.2 0 bottom
AUS7  26.4,95.7 0 bottom
BA  26.42,3.9 90 top
BA2  26.42,28.9 90 top
BA3  26.42,41.4 90 top
BA4  26.42,53.9 90 top
BA5  26.42,66.4 90 top
BA6  26.42,78.9 90 top
BA7  26.42,91.4 90 top
BA.  26.42,16.4 90 top
BE  16.42,3.9 90 top
BE2  16.42,28.9 90 top
BE3  16.42,41.4 90 top
BE4  16.42,53.9 90 top
BE5  16.42,66.4 90 top
BE6  16.42,78.9 90 top
BE7  16.42,91.4 90 top
BE.  16.42,16.4 90 top
C1  49.96,3.56 0 top
C2  78.91,3.56 0 top
C3  50.16,8.13 0 top
C4  50.16,20.63 0 top
C5  78.91,16.06 0 top
C6  49.96,16.06 0 top
C7  50.16,33.13 0 top
C8  78.91,28.56 0 top
C9  49.96,28.56 0 top
C10  50.16,45.63 0 top
C11  78.91,41.06 0 top
C12  49.96,41.06 0 top
C13  50.16,58.13 0 top
C14  78.91,53.56 0 top
C15  49.96,53.56 0 top
C16  50.16,70.63 0 top
C17  78.91,66.06 0 top
C18  49.96,66.06 0 top
C19  50.16,83.13 0 top
C20  78.91,78.56 0 top
C21  49.96,78.56 0 top
C22  50.16,95.63 0 top
C23  78.91,91.06 0 top
C24  49.96,91.06 0 top
D1  37.2,8.33 0 top
D2  80.69,8.13 180 top
D3  37.2,20.83 0 top
D4  80.69,20.63 180 top
D5  37.2,33.33 0 top
D6  80.69,33.13 180 top
D7  37.2,45.83 0 top
D8  80.69,45.63 180 top
D9  37.2,58.33 0 top
D10  80.69,58.13 180 top
D11  37.2,70.83 0 top
D12  80.69,70.63 180 top
D13  37.2,83.33 0 top
D14  80.69,83.13 180 top
D15  37.2,95.83 0 top
D16  80.69,95.63 180 top
EIN  16.4,8.2 0 bottom
EIN1  16.4,20.7 0 bottom
EIN2  16.4,33.2 0 bottom
EIN3  16.4,45.7 0 bottom
EIN4  16.4,58.2 0 bottom
EIN5  16.4,70.7 0 bottom
EIN6  16.4,83.2 0 bottom
EIN7  16.4,95.7 0 bottom
FID1  13,97.5 0 top
FID2  85,3 0 top
FID3  85,15.5 0 top
FID4  13,22.5 0 top
FID5  85,28 0 top
FID6  13,35 0 top
FID7  85,40.5 0 top
FID8  13,47.5 0 top
FID9  85,53 0 top
FID10  13,60 0 top
FID11  85,65.5 0 top
FID12  13,72.5 0 top
FID13  85,78 0 top
FID14  13,85 0 top
FID19  85,90.5 0 top
FID20  13,10 0 top
GND  21.4,8.2 0 bottom
GND12  21.4,20.7 0 bottom
GND20  21.4,33.2 0 bottom
GND29  21.4,45.7 0 bottom
GND39  21.4,58.2 0 bottom
GND47  21.4,70.7 0 bottom
GND55  21.4,83.2 0 bottom
GND63  21.4,95.7 0 bottom
IC1  44.37,5.33 180 top
IC2  61.9,6.1 0 top
IC3  61.9,18.6 0 top
IC4  44.37,17.83 180 top
IC5  61.9,31.1 0 top
IC6  44.37,30.33 180 top
IC7  61.9,43.6 0 top
IC8  44.37,42.83 180 top
IC9  61.9,56.1 0 top
IC10  44.37,55.33 180 top
IC11  61.9,68.6 0 top
IC12  44.37,67.83 180 top
IC13  61.9,81.1 0 top
IC14  44.37,80.33 180 top
IC15  61.9,93.6 0 top
IC16  44.37,92.83 180 top
R1  38.53,3.56 180 top
R2  67.99,3.56 180 top
R3  67.99,8.13 180 top
R4  73.33,3.56 0 top
R5  55.8,8.13 180 top
R6  55.8,3.56 0 top
R7  73.33,8.13 180 top
R8  67.99,20.63 180 top
R9  73.33,16.06 0 top
R10  73.33,20.63 180 top
R11  55.8,20.63 180 top
R12  55.8,16.06 0 top
R13  38.53,16.06 180 top
R14  67.99,16.06 180 top
R15  67.99,33.13 180 top
R16  73.33,28.56 0 top
R17  73.33,33.13 180 top
R18  55.8,33.13 180 top
R19  55.8,28.56 0 top
R20  38.53,28.56 180 top
R21  67.99,28.56 180 top
R22  67.99,45.63 180 top
R23  73.33,41.06 0 top
R24  73.33,45.63 180 top
R25  55.8,45.63 180 top
R26  55.8,41.06 0 top
R27  38.53,41.06 180 top
R28  67.99,41.06 180 top
R29  67.99,58.13 180 top
R30  73.33,53.56 0 top
R31  73.33,58.13 180 top
R32  55.8,58.13 180 top
R33  55.8,53.56 0 top
R34  38.53,53.56 180 top
R35  67.99,53.56 180 top
R36  67.99,70.63 180 top
R37  73.33,66.06 0 top
R38  73.33,70.63 180 top
R39  55.8,70.63 180 top
R40  55.8,66.06 0 top
R41  38.53,66.06 180 top
R42  67.99,66.06 180 top
R43  67.99,83.13 180 top
R44  73.33,78.56 0 top
R45  73.33,83.13 180 top
R46  55.8,83.13 180 top
R47  55.8,78.56 0 top
R48  38.53,78.56 180 top
R49  67.99,78.56 180 top
R50  67.99,95.63 180 top
R51  73.33,91.06 0 top
R52  73.33,95.63 180 top
R53  55.8,95.63 180 top
R54  55.8,91.06 0 top
R55  38.53,91.06 180 top
R56  67.99,91.06 180 top
U$1  [CE_10.00]  63.91,2.2 0 bottom
U$2  [CE_10.00]  63.91,14.7 0 bottom
U$3  [CE_10.00]  63.91,27.2 0 bottom
U$4  [CE_10.00]  63.91,39.7 0 bottom
U$5  [CE_10.00]  63.91,52.2 0 bottom
U$6  [CE_10.00]  63.91,64.7 0 bottom
U$7  [CE_10.00]  63.91,77.2 0 bottom
U$8  [CE_10.00]  63.91,89.7 0 bottom

### Tracks (layer width: path | path; a pad name or v marks a point on that pad's centre or on a via)
+12V  (7 unrouted)
  Top 0.305: 34.46,8.13 D1.1 | 31.92,4.06 +.P$1 | 34.46,20.63 D3.1 | 31.92,16.56 +..P$1 | 34.46,33.13 D5.1 | 31.92,29.06 +2.P$1 | 34.46,45.63 D7.1 | 31.92,41.56 +3.P$1 | 34.46,58.13 D9.1 | 31.92,54.06 +4.P$1 | 34.46,70.63 D11.1 | 31.92,66.56 +5.P$1 | 34.46,83.13 D13.1 | 31.92,79.06 +6.P$1 | 34.46,95.63 D15.1 | 31.92,91.56 +7.P$1
  Top 0.406: 34.46,8.13 34.46,6.6 31.92,4.06 | 34.46,20.63 34.46,19.1 31.92,16.56 | 34.46,33.13 34.46,31.6 31.92,29.06 | 34.46,45.63 34.46,44.1 31.92,41.56 | 34.46,58.13 34.46,56.6 31.92,54.06 | 34.46,70.63 34.46,69.1 31.92,66.56 | 34.46,83.13 34.46,81.6 31.92,79.06 | 34.46,95.63 34.46,94.1 31.92,91.56
  Bottom 0.406: +12V.TP 31.4,3.92 +.P$1 | +12V1.TP 31.4,16.42 +..P$1 | +12V2.TP 31.4,28.92 +2.P$1 | +12V3.TP 31.4,41.42 +3.P$1 | +12V4.TP 31.4,53.92 +4.P$1 | +12V5.TP 31.4,66.42 +5.P$1 | +12V6.TP 31.4,78.92 +6.P$1 | +12V7.TP 31.4,91.42 +7.P$1
+12V1
  Top 0.305: 26.84,4.06 BA.P$1
  Top 0.406: 26.84,4.06 32.69,10.92 60.88,10.92 61.26,10.54 | IC2.7 61.26,10.54 | R7.1 74.22,9.02 73.07,10.92 61.39,10.92 61.26,10.54
  Bottom 0.406: AUS.TP 26.4,3.92 BA.P$1
+12V2
  Top 0.305: 26.84,16.56 BA..P$1
  Top 0.406: 26.84,16.56 32.69,23.42 60.88,23.42 61.26,23.04 | IC3.7 61.26,23.04 | R10.1 74.22,21.52 73.07,23.42 61.39,23.42 61.26,23.04
  Bottom 0.406: AUS1.TP 26.4,16.42 BA..P$1
+12V3
  Top 0.305: 26.84,29.06 BA2.P$1
  Top 0.406: 26.84,29.06 32.69,35.92 60.88,35.92 61.26,35.54 | IC5.7 61.26,35.54 | R17.1 74.22,34.02 73.07,35.92 61.39,35.92 61.26,35.54
  Bottom 0.406: AUS2.TP 26.4,28.92 BA2.P$1
+12V4
  Top 0.305: 26.84,41.56 BA3.P$1
  Top 0.406: 26.84,41.56 32.69,48.42 60.88,48.42 61.26,48.04 | IC7.7 61.26,48.04 | R24.1 74.22,46.52 73.07,48.42 61.39,48.42 61.26,48.04
  Bottom 0.406: AUS3.TP 26.4,41.42 BA3.P$1
+12V5
  Top 0.305: 26.84,54.06 BA4.P$1
  Top 0.406: 26.84,54.06 32.69,60.92 60.88,60.92 61.26,60.54 | IC9.7 61.26,60.54 | R31.1 74.22,59.02 73.07,60.92 61.39,60.92 61.26,60.54
  Bottom 0.406: AUS4.TP 26.4,53.92 BA4.P$1
+12V6
  Top 0.305: 26.84,66.56 BA5.P$1
  Top 0.406: 26.84,66.56 32.69,73.42 60.88,73.42 61.26,73.04 | IC11.7 61.26,73.04 | R38.1 74.22,71.52 73.07,73.42 61.39,73.42 61.26,73.04
  Bottom 0.406: AUS5.TP 26.4,66.42 BA5.P$1
+12V7
  Top 0.305: 26.84,79.06 BA6.P$1
  Top 0.406: 26.84,79.06 32.69,85.92 60.88,85.92 61.26,85.54 | IC13.7 61.26,85.54 | R45.1 74.22,84.02 73.07,85.92 61.39,85.92 61.26,85.54
  Bottom 0.406: AUS6.TP 26.4,78.92 BA6.P$1
+12V8
  Top 0.305: 26.84,91.56 BA7.P$1
  Top 0.406: 26.84,91.56 32.69,98.42 60.88,98.42 61.26,98.04 | IC15.7 61.26,98.04 | R52.1 74.22,96.52 73.07,98.42 61.39,98.42 61.26,98.04
  Bottom 0.406: AUS7.TP 26.4,91.42 BA7.P$1
GND  (via drill 0.6)  (7 unrouted)
  other vias: 52.75,3.56 70.53,1.27 83.23,10.67 81.71,3.56 65.2,1.27 44.35,9.56 47.35,5.56 21.46,10.61 52.75,16.06 70.53,13.77 83.23,23.17 81.71,16.06 65.2,13.77 44.35,22.06 47.35,18.06 21.46,23.11 52.75,28.56 70.53,26.27 83.23,35.67 81.71,28.56 65.2,26.27 44.35,34.56 47.35,30.56 21.46,35.61 52.75,41.06 70.53,38.77 83.23,48.17 81.71,41.06 65.2,38.77 44.35,47.06 47.35,43.06 21.46,48.11 52.75,53.56 70.53,51.27 83.23,60.67 81.71,53.56 65.2,51.27 44.35,59.56 47.35,55.56 21.46,60.61 52.75,66.06 70.53,63.77 83.23,73.17 81.71,66.06 65.2,63.77 44.35,72.06 47.35,68.06 21.46,73.11 52.75,78.56 70.53,76.27 83.23,85.67 81.71,78.56 65.2,76.27 44.35,84.56 47.35,80.56 21.46,85.61 52.75,91.06 70.53,88.77 83.23,98.17 81.71,91.06 65.2,88.77 44.35,97.06 47.35,93.06 21.46,98.11
  pour Top (rank 3): 90.77,12.19 5.06,12.19 5.06,4.06 9.18,3.81 11.85,-0.13 90.52,-0.38
  pour Bottom: 90.62,12.19 4.56,12.19 4.81,-0.38 90.77,-0.38
  pour Top (rank 3): 90.77,24.69 5.06,24.69 5.06,16.56 9.18,16.31 11.85,12.37 90.52,12.12
  pour Bottom: 90.62,24.69 4.56,24.69 4.81,12.12 90.77,12.12
  pour Top (rank 3): 90.77,37.19 5.06,37.19 5.06,29.06 9.18,28.81 11.85,24.87 90.52,24.62
  pour Bottom: 90.62,37.19 4.56,37.19 4.81,24.62 90.77,24.62
  pour Top (rank 3): 90.77,49.69 5.06,49.69 5.06,41.56 9.18,41.31 11.85,37.37 90.52,37.12
  pour Bottom: 90.62,49.69 4.56,49.69 4.81,37.12 90.77,37.12
  pour Top (rank 3): 90.77,62.19 5.06,62.19 5.06,54.06 9.18,53.81 11.85,49.87 90.52,49.62
  pour Bottom: 90.62,62.19 4.56,62.19 4.81,49.62 90.77,49.62
  pour Top (rank 3): 90.77,74.69 5.06,74.69 5.06,66.56 9.18,66.31 11.85,62.37 90.52,62.12
  pour Bottom: 90.62,74.69 4.56,74.69 4.81,62.12 90.77,62.12
  pour Top (rank 3): 90.77,87.19 5.06,87.19 5.06,79.06 9.18,78.81 11.85,74.87 90.52,74.62
  pour Bottom: 90.62,87.19 4.56,87.19 4.81,74.62 90.77,74.62
  pour Top (rank 3): 90.77,99.69 5.06,99.69 5.06,91.56 9.18,91.31 11.85,87.37 90.52,87.12
  pour Bottom: 90.62,99.69 4.56,99.69 4.81,87.12 90.77,87.12
N$1
  Top 0.406: R14.2 65.71,17.83 61.64,17.83 61.39,17.58 IC3.2
N$2
  Top 0.305: 59.86,16.06 IC3.1
  Top 0.406: R8.2 65.71,18.6 60.37,18.6 59.86,17.83 59.86,16.06
N$4
  Top 0.305: 72.06,16.06 R9.1 72.56,15.55 | 69.01,20.12 R8.1 | 77.64,15.55 C5.1
  Top 0.406: 72.06,16.06 72.06,17.07 69.01,20.12 | 77.64,15.55 76.88,15.55 76.12,14.28 73.33,14.28 72.56,15.55
N$5
  Top 0.305: 40.31,8.89 D1.2
  Top 0.406: 40.31,8.89 42.08,8.89 IC1.3
N$6
  Top 0.305: 72.31,20.63 R10.2 | 78.66,20.12 D4.2
  Top 0.406: 72.31,20.63 71.29,22.41 63.93,22.41 IC3.5 | R10.2 72.56,20.25 72.56,18.85 72.82,18.6 | D4.2 78.15,20.37 76.12,18.6 72.82,18.6 | 72.82,18.6 74.09,17.33 74.09,15.93 R9.2
N$7
  Top 0.406: R2.2 65.71,5.33 61.64,5.33 61.39,5.08 IC2.2
N$8
  Top 0.305: 56.82,16.06 R12.2 | 56.82,20.63 R11.1 | 62.4,21.14 IC3.6
  Top 0.406: 56.82,20.63 56.82,19.36 | 56.82,19.36 56.82,16.06 | 62.4,21.14 62.4,19.87 61.9,19.36 56.82,19.36
N$9
  Top 0.305: 37.26,16.06 R13.2 | 16.68,16.06 BE..P$1
  Top 0.406: 37.26,16.06 35.43,12.82 18.92,12.82 16.68,16.06
  Bottom 0.406: BE..P$1 16.42,20.68 EIN1.TP
N$10
  Top 0.406: R13.1 41.07,14.53 41.83,13.77 49.2,13.77 | 49.2,13.77 61.9,13.77 62.4,14.53 62.4,15.87 IC3.3 | C6.1 49.07,13.9 49.2,13.77
N$11
  Top 0.305: 40.31,21.39 D3.2
  Top 0.406: 40.31,21.39 42.08,21.39 IC4.3
N$17
  Top 0.406: R21.2 65.71,30.33 61.64,30.33 61.39,30.08 IC5.2
N$18
  Top 0.305: 59.86,28.56 IC5.1
  Top 0.406: R15.2 65.71,31.1 60.37,31.1 59.86,30.33 59.86,28.56
N$19
  Top 0.305: 72.06,28.56 R16.1 72.56,28.05 | 69.01,32.62 R15.1 | 77.64,28.05 C8.1
  Top 0.406: 72.06,28.56 72.06,29.57 69.01,32.62 | 77.64,28.05 76.88,28.05 76.12,26.78 73.33,26.78 72.56,28.05
N$20
  Top 0.305: 72.31,33.13 R17.2 | 78.66,32.62 D6.2
  Top 0.406: 72.31,33.13 71.29,34.91 63.93,34.91 IC5.5 | R17.2 72.56,32.75 72.56,31.35 72.82,31.1 | D6.2 78.15,32.87 76.12,31.1 72.82,31.1 | 72.82,31.1 74.09,29.83 74.09,28.43 R16.2
N$21
  Top 0.305: 56.82,28.56 R19.2 | 56.82,33.13 R18.1 | 62.4,33.64 IC5.6
  Top 0.406: 56.82,33.13 56.82,31.86 | 56.82,31.86 56.82,28.56 | 62.4,33.64 62.4,32.37 61.9,31.86 56.82,31.86
N$22
  Top 0.305: 37.26,28.56 R20.2 | 16.68,28.56 BE2.P$1
  Top 0.406: 37.26,28.56 35.43,25.32 18.92,25.32 16.68,28.56
  Bottom 0.406: BE2.P$1 16.42,33.18 EIN2.TP
N$23
  Top 0.305: 37.26,3.56 R1.2 | 16.68,3.56 BE.P$1
  Top 0.406: 37.26,3.56 35.43,0.32 18.92,0.32 16.68,3.56
  Bottom 0.406: BE.P$1 16.42,8.18 EIN.TP
N$24
  Top 0.406: R1.1 41.07,2.03 41.83,1.27 49.2,1.27 | 49.2,1.27 61.9,1.27 62.4,2.03 62.4,3.37 IC2.3 | C1.1 49.07,1.4 49.2,1.27
N$25
  Top 0.406: R20.1 41.07,27.03 41.83,26.27 49.2,26.27 | 49.2,26.27 61.9,26.27 62.4,27.03 62.4,28.37 IC5.3 | C9.1 49.07,26.4 49.2,26.27
N$26
  Top 0.305: 40.31,33.89 D5.2
  Top 0.406: 40.31,33.89 42.08,33.89 IC6.3
N$27
  Top 0.406: R28.2 65.71,42.83 61.64,42.83 61.39,42.58 IC7.2
N$28
  Top 0.305: 59.86,41.06 IC7.1
  Top 0.406: R22.2 65.71,43.6 60.37,43.6 59.86,42.83 59.86,41.06
N$29
  Top 0.305: 72.06,41.06 R23.1 72.56,40.55 | 69.01,45.12 R22.1 | 77.64,40.55 C11.1
  Top 0.406: 72.06,41.06 72.06,42.07 69.01,45.12 | 77.64,40.55 76.88,40.55 76.12,39.28 73.33,39.28 72.56,40.55
N$30
  Top 0.305: 72.31,45.63 R24.2 | 78.66,45.12 D8.2
  Top 0.406: 72.31,45.63 71.29,47.41 63.93,47.41 IC7.5 | R24.2 72.56,45.25 72.56,43.85 72.82,43.6 | D8.2 78.15,45.37 76.12,43.6 72.82,43.6 | 72.82,43.6 74.09,42.33 74.09,40.93 R23.2
N$31
  Top 0.305: 56.82,41.06 R26.2 | 56.82,45.63 R25.1 | 62.4,46.14 IC7.6
  Top 0.406: 56.82,45.63 56.82,44.36 | 56.82,44.36 56.82,41.06 | 62.4,46.14 62.4,44.87 61.9,44.36 56.82,44.36
N$32
  Top 0.305: 37.26,41.06 R27.2 | 16.68,41.06 BE3.P$1
  Top 0.406: 37.26,41.06 35.43,37.82 18.92,37.82 16.68,41.06
  Bottom 0.406: BE3.P$1 16.42,45.68 EIN3.TP
N$33
  Top 0.406: R27.1 41.07,39.53 41.83,38.77 49.2,38.77 | 49.2,38.77 61.9,38.77 62.4,39.53 62.4,40.87 IC7.3 | C12.1 49.07,38.9 49.2,38.77
N$34
  Top 0.305: 40.31,46.39 D7.2
  Top 0.406: 40.31,46.39 42.08,46.39 IC8.3
N$46
  Top 0.406: R35.2 65.71,55.33 61.64,55.33 61.39,55.08 IC9.2
N$47
  Top 0.305: 59.86,53.56 IC9.1
  Top 0.406: R29.2 65.71,56.1 60.37,56.1 59.86,55.33 59.86,53.56
N$48
  Top 0.305: 72.06,53.56 R30.1 72.56,53.05 | 69.01,57.62 R29.1 | 77.64,53.05 C14.1
  Top 0.406: 72.06,53.56 72.06,54.57 69.01,57.62 | 77.64,53.05 76.88,53.05 76.12,51.78 73.33,51.78 72.56,53.05
N$49
  Top 0.305: 72.31,58.13 R31.2 | 78.66,57.62 D10.2
  Top 0.406: 72.31,58.13 71.29,59.91 63.93,59.91 IC9.5 | R31.2 72.56,57.75 72.56,56.35 72.82,56.1 | D10.2 78.15,57.87 76.12,56.1 72.82,56.1 | 72.82,56.1 74.09,54.83 74.09,53.43 R30.2
N$50
  Top 0.305: 56.82,53.56 R33.2 | 56.82,58.13 R32.1 | 62.4,58.64 IC9.6
  Top 0.406: 56.82,58.13 56.82,56.86 | 56.82,56.86 56.82,53.56 | 62.4,58.64 62.4,57.37 61.9,56.86 56.82,56.86
N$51
  Top 0.305: 37.26,53.56 R34.2 | 16.68,53.56 BE4.P$1
  Top 0.406: 37.26,53.56 35.43,50.32 18.92,50.32 16.68,53.56
  Bottom 0.406: BE4.P$1 16.42,58.18 EIN4.TP
N$52
  Top 0.406: R34.1 41.07,52.03 41.83,51.27 49.2,51.27 | 49.2,51.27 61.9,51.27 62.4,52.03 62.4,53.37 IC9.3 | C15.1 49.07,51.4 49.2,51.27
N$53
  Top 0.305: 40.31,58.89 D9.2
  Top 0.406: 40.31,58.89 42.08,58.89 IC10.3
N$54
  Top 0.406: R42.2 65.71,67.83 61.64,67.83 61.39,67.58 IC11.2
N$55
  Top 0.305: 59.86,66.06 IC11.1
  Top 0.406: R36.2 65.71,68.6 60.37,68.6 59.86,67.83 59.86,66.06
N$56
  Top 0.305: 72.06,66.06 R37.1 72.56,65.55 | 69.01,70.12 R36.1 | 77.64,65.55 C17.1
  Top 0.406: 72.06,66.06 72.06,67.07 69.01,70.12 | 77.64,65.55 76.88,65.55 76.12,64.28 73.33,64.28 72.56,65.55
N$57
  Top 0.305: 72.31,70.63 R38.2 | 78.66,70.12 D12.2
  Top 0.406: 72.31,70.63 71.29,72.41 63.93,72.41 IC11.5 | R38.2 72.56,70.25 72.56,68.85 72.82,68.6 | D12.2 78.15,70.37 76.12,68.6 72.82,68.6 | 72.82,68.6 74.09,67.33 74.09,65.93 R37.2
N$58
  Top 0.305: 56.82,66.06 R40.2 | 56.82,70.63 R39.1 | 62.4,71.14 IC11.6
  Top 0.406: 56.82,70.63 56.82,69.36 | 56.82,69.36 56.82,66.06 | 62.4,71.14 62.4,69.87 61.9,69.36 56.82,69.36
N$59
  Top 0.305: 37.26,66.06 R41.2 | 16.68,66.06 BE5.P$1
  Top 0.406: 37.26,66.06 35.43,62.82 18.92,62.82 16.68,66.06
  Bottom 0.406: BE5.P$1 16.42,70.68 EIN5.TP
N$60
  Top 0.406: R41.1 41.07,64.53 41.83,63.77 49.2,63.77 | 49.2,63.77 61.9,63.77 62.4,64.53 62.4,65.87 IC11.3 | C18.1 49.07,63.9 49.2,63.77
N$61
  Top 0.305: 40.31,71.39 D11.2
  Top 0.406: 40.31,71.39 42.08,71.39 IC12.3
N$63
  Top 0.406: R49.2 65.71,80.33 61.64,80.33 61.39,80.08 IC13.2
N$64
  Top 0.305: 59.86,78.56 IC13.1
  Top 0.406: R43.2 65.71,81.1 60.37,81.1 59.86,80.33 59.86,78.56
N$65
  Top 0.305: 72.06,78.56 R44.1 72.56,78.05 | 69.01,82.62 R43.1 | 77.64,78.05 C20.1
  Top 0.406: 72.06,78.56 72.06,79.57 69.01,82.62 | 77.64,78.05 76.88,78.05 76.12,76.78 73.33,76.78 72.56,78.05
N$67
  Top 0.305: 72.31,83.13 R45.2 | 78.66,82.62 D14.2
  Top 0.406: 72.31,83.13 71.29,84.91 63.93,84.91 IC13.5 | R45.2 72.56,82.75 72.56,81.35 72.82,81.1 | D14.2 78.15,82.87 76.12,81.1 72.82,81.1 | 72.82,81.1 74.09,79.83 74.09,78.43 R44.2
N$69
  Top 0.305: 56.82,78.56 R47.2 | 56.82,83.13 R46.1 | 62.4,83.64 IC13.6
  Top 0.406: 56.82,83.13 56.82,81.86 | 56.82,81.86 56.82,78.56 | 62.4,83.64 62.4,82.37 61.9,81.86 56.82,81.86
N$70
  Top 0.305: 37.26,78.56 R48.2 | 16.68,78.56 BE6.P$1
  Top 0.406: 37.26,78.56 35.43,75.32 18.92,75.32 16.68,78.56
  Bottom 0.406: BE6.P$1 16.42,83.18 EIN6.TP
N$71
  Top 0.406: R48.1 41.07,77.03 41.83,76.27 49.2,76.27 | 49.2,76.27 61.9,76.27 62.4,77.03 62.4,78.37 IC13.3 | C21.1 49.07,76.4 49.2,76.27
N$72
  Top 0.305: 40.31,83.89 D13.2
  Top 0.406: 40.31,83.89 42.08,83.89 IC14.3
N$73
  Top 0.406: R56.2 65.71,92.83 61.64,92.83 61.39,92.58 IC15.2
N$74
  Top 0.305: 59.86,91.06 IC15.1
  Top 0.406: R50.2 65.71,93.6 60.37,93.6 59.86,92.83 59.86,91.06
N$76
  Top 0.305: 72.06,91.06 R51.1 72.56,90.55 | 69.01,95.12 R50.1 | 77.64,90.55 C23.1
  Top 0.406: 72.06,91.06 72.06,92.07 69.01,95.12 | 77.64,90.55 76.88,90.55 76.12,89.28 73.33,89.28 72.56,90.55
N$77
  Top 0.305: 72.31,95.63 R52.2 | 78.66,95.12 D16.2
  Top 0.406: 72.31,95.63 71.29,97.41 63.93,97.41 IC15.5 | R52.2 72.56,95.25 72.56,93.85 72.82,93.6 | D16.2 78.15,95.37 76.12,93.6 72.82,93.6 | 72.82,93.6 74.09,92.33 74.09,90.93 R51.2
N$78
  Top 0.305: 56.82,91.06 R54.2 | 56.82,95.63 R53.1 | 62.4,96.14 IC15.6
  Top 0.406: 56.82,95.63 56.82,94.36 | 56.82,94.36 56.82,91.06 | 62.4,96.14 62.4,94.87 61.9,94.36 56.82,94.36
N$79
  Top 0.305: 37.26,91.06 R55.2 | 16.68,91.06 BE7.P$1
  Top 0.406: 37.26,91.06 35.43,87.82 18.92,87.82 16.68,91.06
  Bottom 0.406: BE7.P$1 16.42,95.68 EIN7.TP
N$80
  Top 0.406: R55.1 41.07,89.53 41.83,88.77 49.2,88.77 | 49.2,88.77 61.9,88.77 62.4,89.53 62.4,90.87 IC15.3 | C24.1 49.07,88.9 49.2,88.77
N$81
  Top 0.305: 40.31,96.39 D15.2
  Top 0.406: 40.31,96.39 42.08,96.39 IC16.3
N$92
  Top 0.305: 59.86,3.56 IC2.1
  Top 0.406: R3.2 65.71,6.1 60.37,6.1 59.86,5.33 59.86,3.56
N$96
  Top 0.305: 72.06,3.56 R4.1 72.56,3.05 | 69.01,7.62 R3.1 | 77.64,3.05 C2.1
  Top 0.406: 72.06,3.56 72.06,4.57 69.01,7.62 | 77.64,3.05 76.88,3.05 76.12,1.78 73.33,1.78 72.56,3.05
N$97
  Top 0.305: 72.31,8.13 R7.2 | 78.66,7.62 D2.2
  Top 0.406: 72.31,8.13 71.29,9.91 63.93,9.91 IC2.5 | R7.2 72.56,7.75 72.56,6.35 72.82,6.1 | D2.2 78.15,7.87 76.12,6.1 72.82,6.1 | 72.82,6.1 74.09,4.83 74.09,3.43 R4.2
N$101
  Top 0.305: 56.82,3.56 R6.2 | 56.82,8.13 R5.1 | 62.4,8.64 IC2.6
  Top 0.406: 56.82,8.13 56.82,6.86 | 56.82,6.86 56.82,3.56 | 62.4,8.64 62.4,7.37 61.9,6.86 56.82,6.86
VCC  (via drill 0.6)  (7 unrouted)
  Top 0.406: IC1.1 45.87,8.4 | 45.87,8.4 45.87,9.04 45.89,9.14 46.4,9.65 49.2,9.65 | 49.2,9.65 54.78,9.65 | 54.78,8.64 R5.2 54.91,9.53 54.78,9.65 | 54.78,9.65 59.03,9.65 IC2.8 | C3.1 49.07,9.53 49.2,9.65 | v47.4,8.2 46.07,8.2 45.87,8.4 | IC4.1 45.87,20.9 | 45.87,20.9 45.87,21.54 45.89,21.64 46.4,22.15 49.2,22.15 | 49.2,22.15 54.78,22.15 | 54.78,21.14 R11.2 54.91,22.02 54.78,22.15 | 54.78,22.15 59.03,22.15 IC3.8 | C4.1 49.07,22.02 49.2,22.15 | v47.4,20.7 46.07,20.7 45.87,20.9 | IC6.1 45.87,33.4 | 45.87,33.4 45.87,34.04 45.89,34.14 46.4,34.65 49.2,34.65 | 49.2,34.65 54.78,34.65 | 54.78,33.64 R18.2 54.91,34.52 54.78,34.65 | 54.78,34.65 59.03,34.65 IC5.8 | C7.1 49.07,34.52 49.2,34.65 | v47.4,33.2 46.07,33.2 45.87,33.4 | IC8.1 45.87,45.9 | 45.87,45.9 45.87,46.54 45.89,46.64 46.4,47.15 49.2,47.15 | 49.2,47.15 54.78,47.15 | 54.78,46.14 R25.2 54.91,47.02 54.78,47.15 | 54.78,47.15 59.03,47.15 IC7.8 | C10.1 49.07,47.02 49.2,47.15 | v47.4,45.7 46.07,45.7 45.87,45.9 | IC10.1 45.87,58.4 | 45.87,58.4 45.87,59.04 45.89,59.14 46.4,59.65 49.2,59.65 | 49.2,59.65 54.78,59.65 | 54.78,58.64 R32.2 54.91,59.52 54.78,59.65 | 54.78,59.65 59.03,59.65 IC9.8 | C13.1 49.07,59.52 49.2,59.65 | v47.4,58.2 46.07,58.2 45.87,58.4 | IC12.1 45.87,70.9 | 45.87,70.9 45.87,71.54 45.89,71.64 46.4,72.15 49.2,72.15 | 49.2,72.15 54.78,72.15 | 54.78,71.14 R39.2 54.91,72.03 54.78,72.15 | 54.78,72.15 59.03,72.15 IC11.8 | C16.1 49.07,72.03 49.2,72.15 | v47.4,70.7 46.07,70.7 45.87,70.9 | IC14.1 45.87,83.4 | 45.87,83.4 45.87,84.04 45.89,84.14 46.4,84.65 49.2,84.65 | 49.2,84.65 54.78,84.65 | 54.78,83.64 R46.2 54.91,84.53 54.78,84.65 | 54.78,84.65 59.03,84.65 IC13.8 | C19.1 49.07,84.53 49.2,84.65
  Top 0.406: v47.4,83.2 46.07,83.2 45.87,83.4 | IC16.1 45.87,95.9 | 45.87,95.9 45.87,96.54 45.89,96.64 46.4,97.15 49.2,97.15 | 49.2,97.15 54.78,97.15 | 54.78,96.14 R53.2 54.91,97.03 54.78,97.15 | 54.78,97.15 59.03,97.15 IC15.8 | C22.1 49.07,97.03 49.2,97.15 | v47.4,95.7 46.07,95.7 45.87,95.9
  Bottom 0.406: 6V.TP v47.4,8.2 | 6V1.TP v47.4,20.7 | 6V2.TP v47.4,33.2 | 6V3.TP v47.4,45.7 | 6V4.TP v47.4,58.2 | 6V5.TP v47.4,70.7 | 6V6.TP v47.4,83.2 | 6V7.TP v47.4,95.7

### Text on the board
Dimension: V-CUT | V-CUT | V-CUT | V-CUT | V-CUT | V-CUT | V-CUT | V-CUT | V-CUT | V-CUT | V-CUT | V-CUT | V-CUT | V-CUT
bPlace: QC | QC | QC | QC | QC | QC | QC | QC
tValues: BE - BA + | BE - BA + | BE - BA + | BE - BA + | BE - BA + | BE - BA + | BE - BA +
bValues: EIN GND AUS +12V 6V | EIN GND AUS +12V 6V | EIN GND AUS +12V 6V | EIN GND AUS +12V 6V | EIN GND AUS +12V 6V | EIN GND AUS +12V 6V | EIN GND AUS +12V 6V | EIN GND AUS +12V 6V